# EAGLE design PSoC_PyunPyun_Mini (EAGLE 7.2.0)
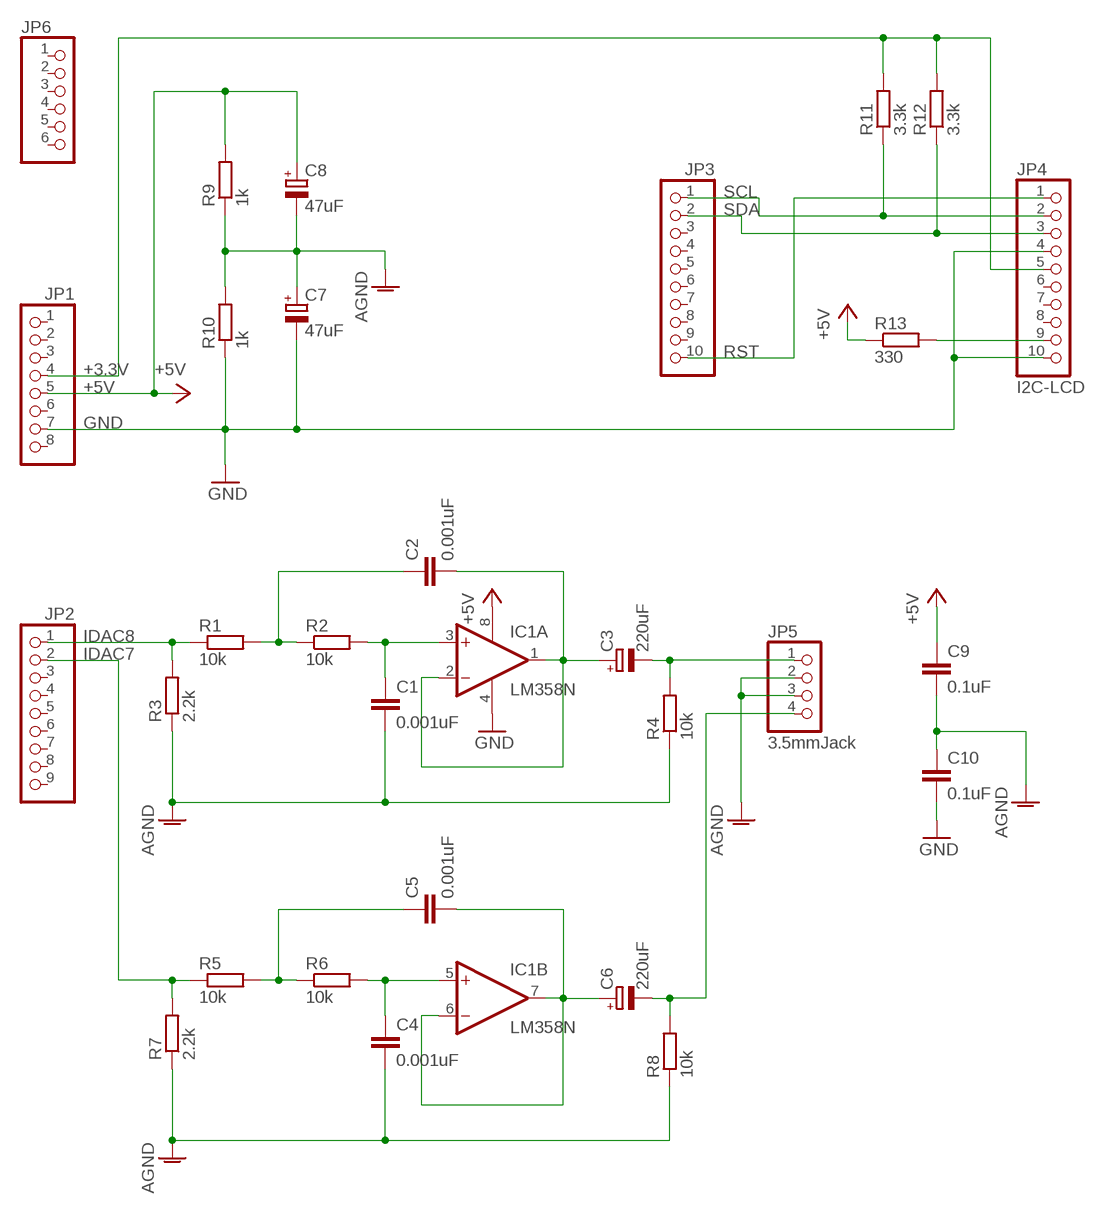
[diagram p0: schematic, sheet 1]

## Parts
C1  0.001uF  C-EU050-024X044  [C050-024X044]
C2  0.001uF  C-EU050-024X044  [C050-024X044]
C3  220uF  CPOL-EUE5-8.5  [E5-8,5]
C4  0.001uF  C-EU050-024X044  [C050-024X044]
C5  0.001uF  C-EU050-024X044  [C050-024X044]
C6  220uF  CPOL-EUE5-8.5  [E5-8,5]
C7  47uF  CPOL-EUE5-5  [E5-5]
C8  47uF  CPOL-EUE5-5  [E5-5]
C9  0.1uF  C-EU050-024X044  [C050-024X044]
C10  0.1uF  C-EU050-024X044  [C050-024X044]
IC1  LM358N  [DIL08]
JP1  PINHD-1X8  [1X08]
JP2  PINHD-1X9  [1X09]
JP3  PINHD-1X10  [1X10]
JP4  I2C-LCD  PINHD-1X10  [1X10]
JP5  3.5mmJack  PINHD-1X4  [1X04]
JP6  PINHD-1X6  [1X06]
R1  10k  R-EU_0207/7  [0207/7]
R2  10k  R-EU_0207/7  [0207/7]
R3  2.2k  R-EU_0207/7  [0207/7]
R4  10k  R-EU_0207/7  [0207/7]
R5  10k  R-EU_0207/7  [0207/7]
R6  10k  R-EU_0207/7  [0207/7]
R7  2.2k  R-EU_0207/7  [0207/7]
R8  10k  R-EU_0207/7  [0207/7]
R9  1k  R-EU_0207/7  [0207/7]
R10  1k  R-EU_0207/7  [0207/7]
R11  3.3k  R-EU_0207/7  [0207/7]
R12  3.3k  R-EU_0207/7  [0207/7]
R13  330  R-EU_0207/7  [0207/7]

## Nets
+3.3V: JP1.4 JP4.5 R11.2 R12.2
+5V: C8.+ C9.1 IC1.8(P:V+) JP1.5 R9.2 R13.1
AGND: C1.2 C4.2 C7.+ C8.- C9.2 C10.1 JP5.2 JP5.3 R3.1 R4.1 R7.1 R8.1 R9.1 R10.2
GND: C7.- C10.2 IC1.4(P:V-) JP1.7 JP4.4 JP4.10 R10.1
IDAC7: JP2.2 R5.1 R7.2
IDAC8: JP2.1 R1.1 R3.2
N$1: C2.1 R1.2 R2.1
N$2: C5.1 R5.2 R6.1
N$3: C1.1 IC1.3(A:+IN) R2.2
N$4: C2.2 C3.+ IC1.1(A:OUT) IC1.2(A:-IN)
N$5: JP4.9 R13.2
N$6: C4.1 IC1.5(B:+IN) R6.2
N$7: C3.- JP5.1 R4.2
N$8: C5.2 C6.+ IC1.6(B:-IN) IC1.7(B:OUT)
N$9: C6.- JP5.4 R8.2
RST: JP3.10 JP4.1
SCL: JP3.1 JP4.2 R11.1
SDA: JP3.2 JP4.3 R12.1
Unconnected: JP1.1 JP1.2 JP1.3 JP1.6 JP1.8 JP2.3 JP2.4 JP2.5 JP2.6 JP2.7 JP2.8 JP2.9 JP3.3 JP3.4 JP3.5 JP3.6 JP3.7 JP3.8 JP3.9 JP4.6 JP4.7 JP4.8 JP6.1 JP6.2 JP6.3 JP6.4 JP6.5 JP6.6

## Library data of the parts
C1 C2 C4 C5 C9 C10 = rcl:C-EU: CAPACITOR, European symbol
C3 C6-C8 = rcl:CPOL-EU: POLARIZED CAPACITOR, European symbol
IC1 = linear:LM358: OP AMP also LM158; LM258; LM2904 Source: http://cache.national.com/ds/LM/LM158.pdf
JP1 = pinhead:PINHD-1X8: PIN HEADER
JP2 = pinhead:PINHD-1X9: PIN HEADER
JP3 JP4 = pinhead:PINHD-1X10: PIN HEADER
JP5 = pinhead:PINHD-1X4: PIN HEADER
JP6 = pinhead:PINHD-1X6: PIN HEADER
R1-R13 = rcl:R-EU_: RESISTOR, European symbol

## Board
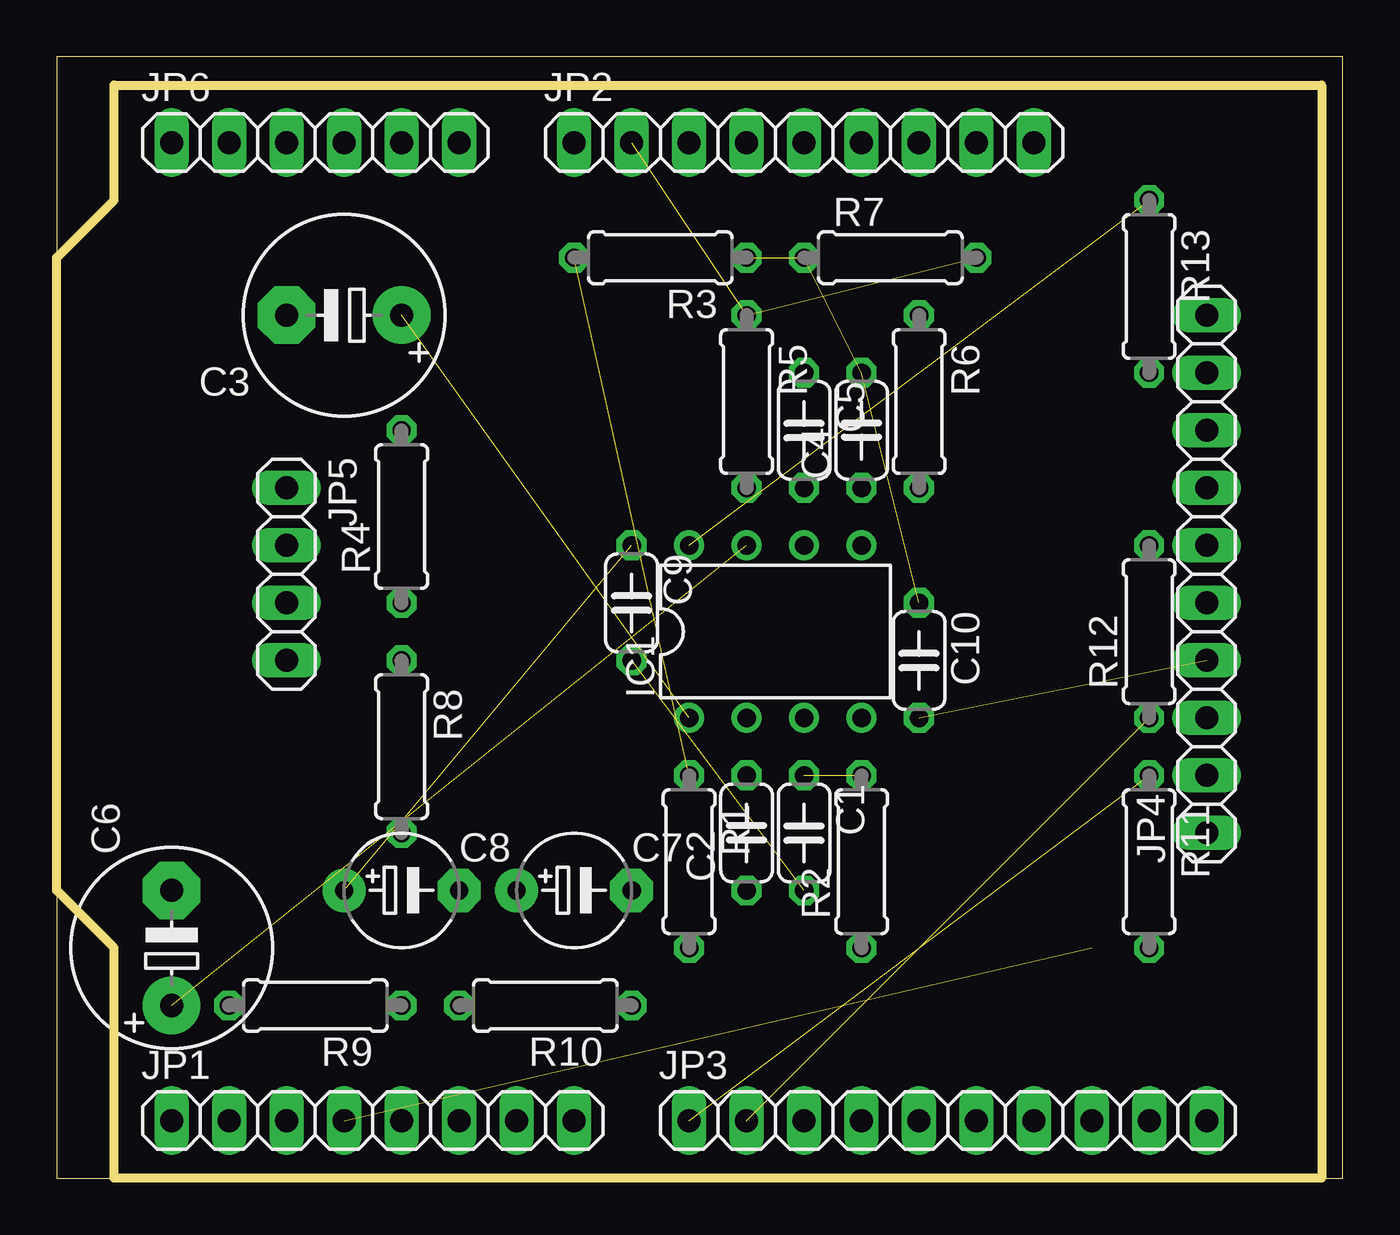
[diagram p1: board, top side]
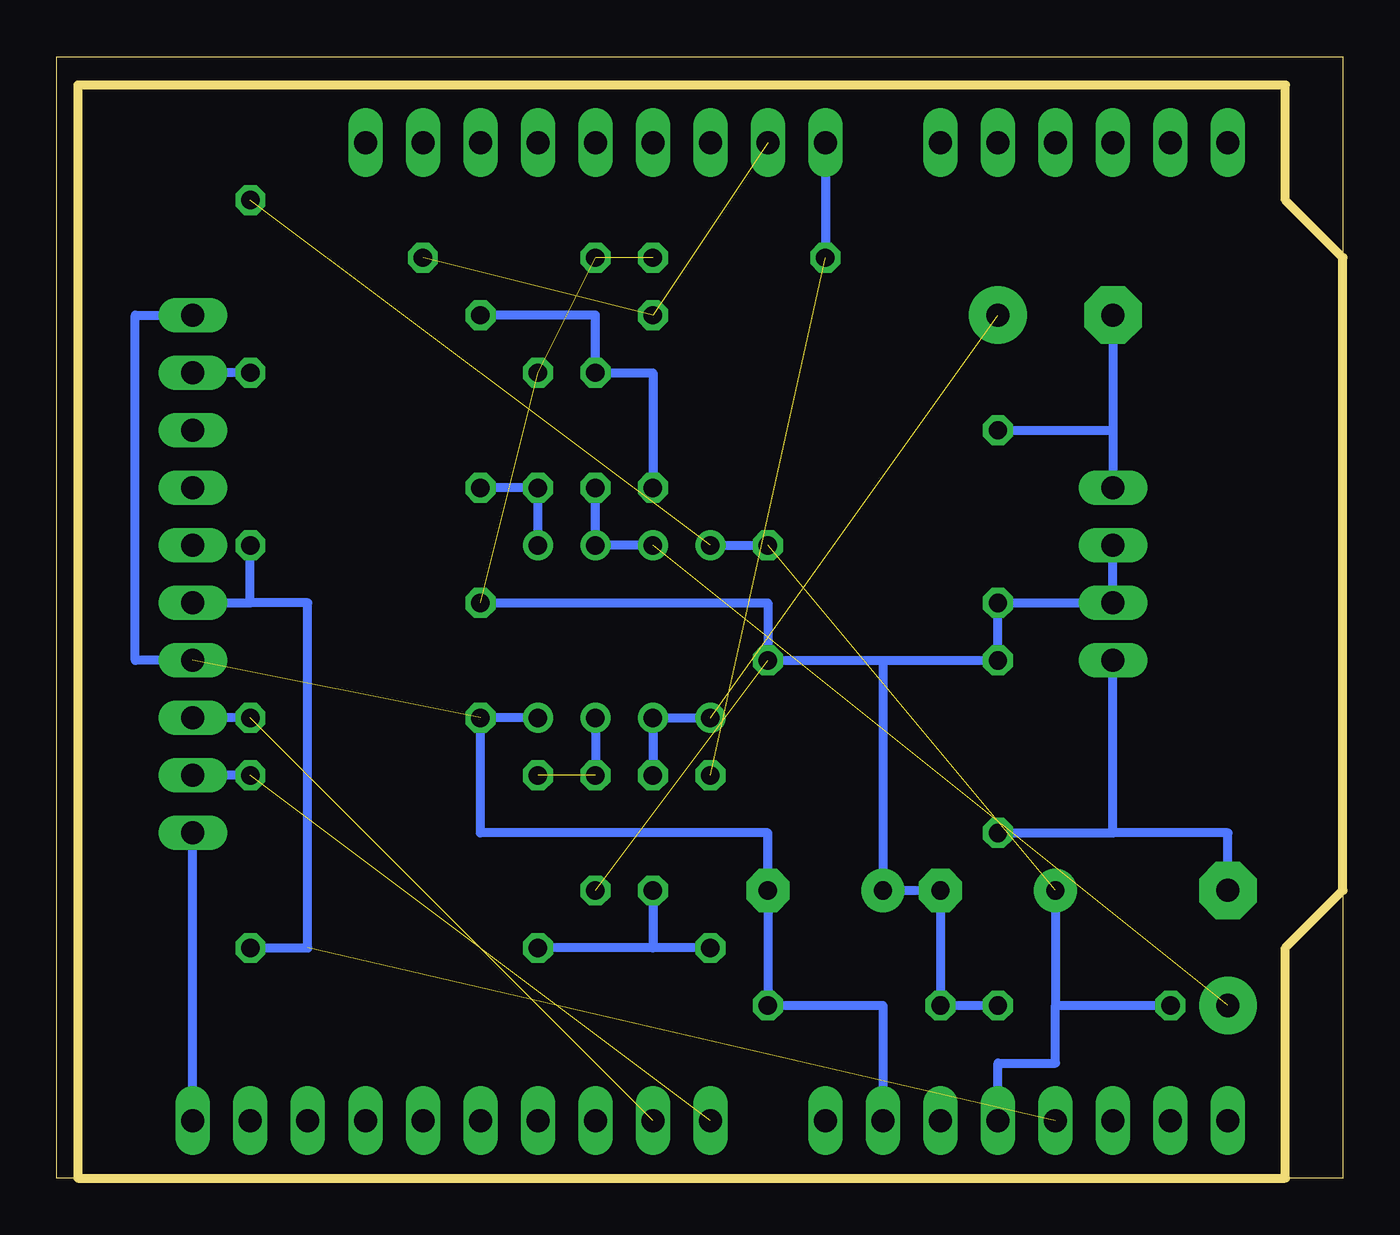
[diagram p2: board, bottom side, seen from below]

Size 56.82 x 49.52 mm. Coordinates in mm from the lower left corner, seen from the top.
Outline: 2.54,0 0,0 0,12.7
Outline: 55.88,0 56.82,0 56.82,49.52 0,49.52 0,40.64
Outline: 0,12.7 0,40.64
Outline: 0,40.64 2.54,43.18 2.54,48.26 55.88,48.26 55.88,0
Outline: 55.88,0 2.54,0
Outline: 2.54,0 2.54,10.16 0,12.7
Copper layers (1*16): Top 0.035mm / dielectric 1.5mm / Bottom 0.035mm
Design rules "default": minimum track width 10mil, minimum drill 24mil, track to track 8mil, track to pad 8mil, pad to pad 8mil, via to via 8mil, smd to smd 8mil, copper to edge 40mil, drill to drill 8mil, minimum pad ring 10mil, minimum via ring 8mil, stop-mask expansion 4mil, vias tented up to drill 0mil, thermal gap 10mil
tKeepout: area -5.1,15.2 to 12.7,33

### Footprints (pad centres in the part's own frame; a part is rotated, then mirrored left to right if it is on the bottom)
C050-024X044 = drill 0.813 octagon: 1 -2.54,0; 2 2.54,0
E5-8,5 = drill 1.016 pad 2.54: + -2.54,0 | drill 1.016 pad 2.54 octagon: - 2.54,0
E5-5 = drill 0.813 pad 1.905: + -2.54,0 | drill 0.813 pad 1.905 octagon: - 2.54,0
DIL08 = drill 0.813 pad 1.27: 1 -3.81,-3.81; 2 -1.27,-3.81; 3 1.27,-3.81; 4 3.81,-3.81; 5 3.81,3.81; 6 1.27,3.81; 7 -1.27,3.81; 8 -3.81,3.81
1X08 = drill 1.016 long: 1 -8.89,0; 2 -6.35,0; 3 -3.81,0; 4 -1.27,0; 5 1.27,0; 6 3.81,0; 7 6.35,0; 8 8.89,0
1X09 = drill 1.016 long: 1 -10.16,0; 2 -7.62,0; 3 -5.08,0; 4 -2.54,0; 5 0,0; 6 2.54,0; 7 5.08,0; 8 7.62,0; 9 10.16,0
1X10 = drill 1.016 long: 1 -11.43,0; 2 -8.89,0; 3 -6.35,0; 4 -3.81,0; 5 -1.27,0; 6 1.27,0; 7 3.81,0; 8 6.35,0; 9 8.89,0; 10 11.43,0
1X04 = drill 1.016 long: 1 -3.81,0; 2 -1.27,0; 3 1.27,0; 4 3.81,0
1X06 = drill 1.016 long: 1 -6.35,0; 2 -3.81,0; 3 -1.27,0; 4 1.27,0; 5 3.81,0; 6 6.35,0
0207/7 = drill 0.813 octagon: 1 -3.81,0; 2 3.81,0

### Placement (x,y rotation side)
C1  33.02,15.24 270 top
C2  30.48,15.24 90 top
C3  12.7,38.1 180 top
C4  35.56,33.02 90 top
C5  33.02,33.02 270 top
C6  5.08,10.16 90 top
C7  22.86,12.7 0 top
C8  15.24,12.7 0 top
C9  25.4,25.4 270 top
C10  38.1,22.86 270 top
IC1  31.75,24.13 0 top
JP1  13.97,2.54 0 top
JP2  33.02,45.72 0 top
JP3  39.37,2.54 0 top
JP4  50.8,26.67 90 top
JP5  10.16,26.67 270 top
JP6  11.43,45.72 0 top
R1  27.94,13.97 270 top
R2  35.56,13.97 90 top
R3  26.67,40.64 180 top
R4  15.24,29.21 90 top
R5  30.48,34.29 270 top
R6  38.1,34.29 270 top
R7  36.83,40.64 0 top
R8  15.24,19.05 270 top
R9  11.43,7.62 180 top
R10  21.59,7.62 180 top
R11  48.26,13.97 270 top
R12  48.26,24.13 90 top
R13  48.26,39.37 270 top

### Tracks (layer width: path | path; a pad name or v marks a point on that pad's centre or on a via)
+3.3V  (1 unrouted)
  Bottom 0.406: JP4.5 48.26,25.4 | 48.26,25.4 R12.2 | R11.2 45.72,10.16 45.72,25.4 48.26,25.4
+5V  (2 unrouted)
  Bottom 0.406: IC1.8 C9.1 | C8.+ 12.7,7.62 | 12.7,7.62 R9.2 | JP1.5 15.24,5.08 12.7,5.08 12.7,7.62
AGND  (4 unrouted)
  Bottom 0.406: C10.1 25.4,25.4 C9.2 | C9.2 R8.1 R4.1 JP5.3 JP5.2 | C9.2 20.32,22.86 C7.+ C8.- R10.2 R9.1
GND  (1 unrouted)
  Bottom 0.406: IC1.4 C10.2 38.1,15.24 25.4,15.24 C7.- R10.1 20.32,7.62 JP1.7 | JP4.4 53.34,22.86 53.34,38.1 JP4.10
IDAC7  (2 unrouted)
IDAC8  (1 unrouted)
  Bottom 0.406: JP2.1 R3.2
N$1
  Bottom 0.406: R1.2 30.48,10.16 | 30.48,10.16 R2.1 | C2.1 30.48,10.16
N$2
  Bottom 0.406: R5.2 30.48,35.56 C5.1 33.02,38.1 R6.1
N$3  (1 unrouted)
  Bottom 0.406: IC1.3 C1.1
N$4  (1 unrouted)
  Bottom 0.406: C2.2 IC1.2 IC1.1
N$5
  Bottom 0.406: R13.2 JP4.9
N$6
  Bottom 0.406: IC1.5 C4.1 R6.2
N$7
  Bottom 0.406: R4.2 10.16,33.02 | 10.16,33.02 JP5.1 | C3.- 10.16,33.02
N$8  (1 unrouted)
  Bottom 0.406: IC1.7 IC1.6 C5.2
N$9
  Bottom 0.406: R8.2 10.16,15.24 | 10.16,15.24 JP5.4 | C6.- 5.08,15.24 10.16,15.24
RST
  Bottom 0.406: JP3.10 JP4.1
SCL  (1 unrouted)
  Bottom 0.406: R11.1 JP4.2
SDA  (1 unrouted)
  Bottom 0.406: R12.1 JP4.3